# Altium project Compass.PrjPcb
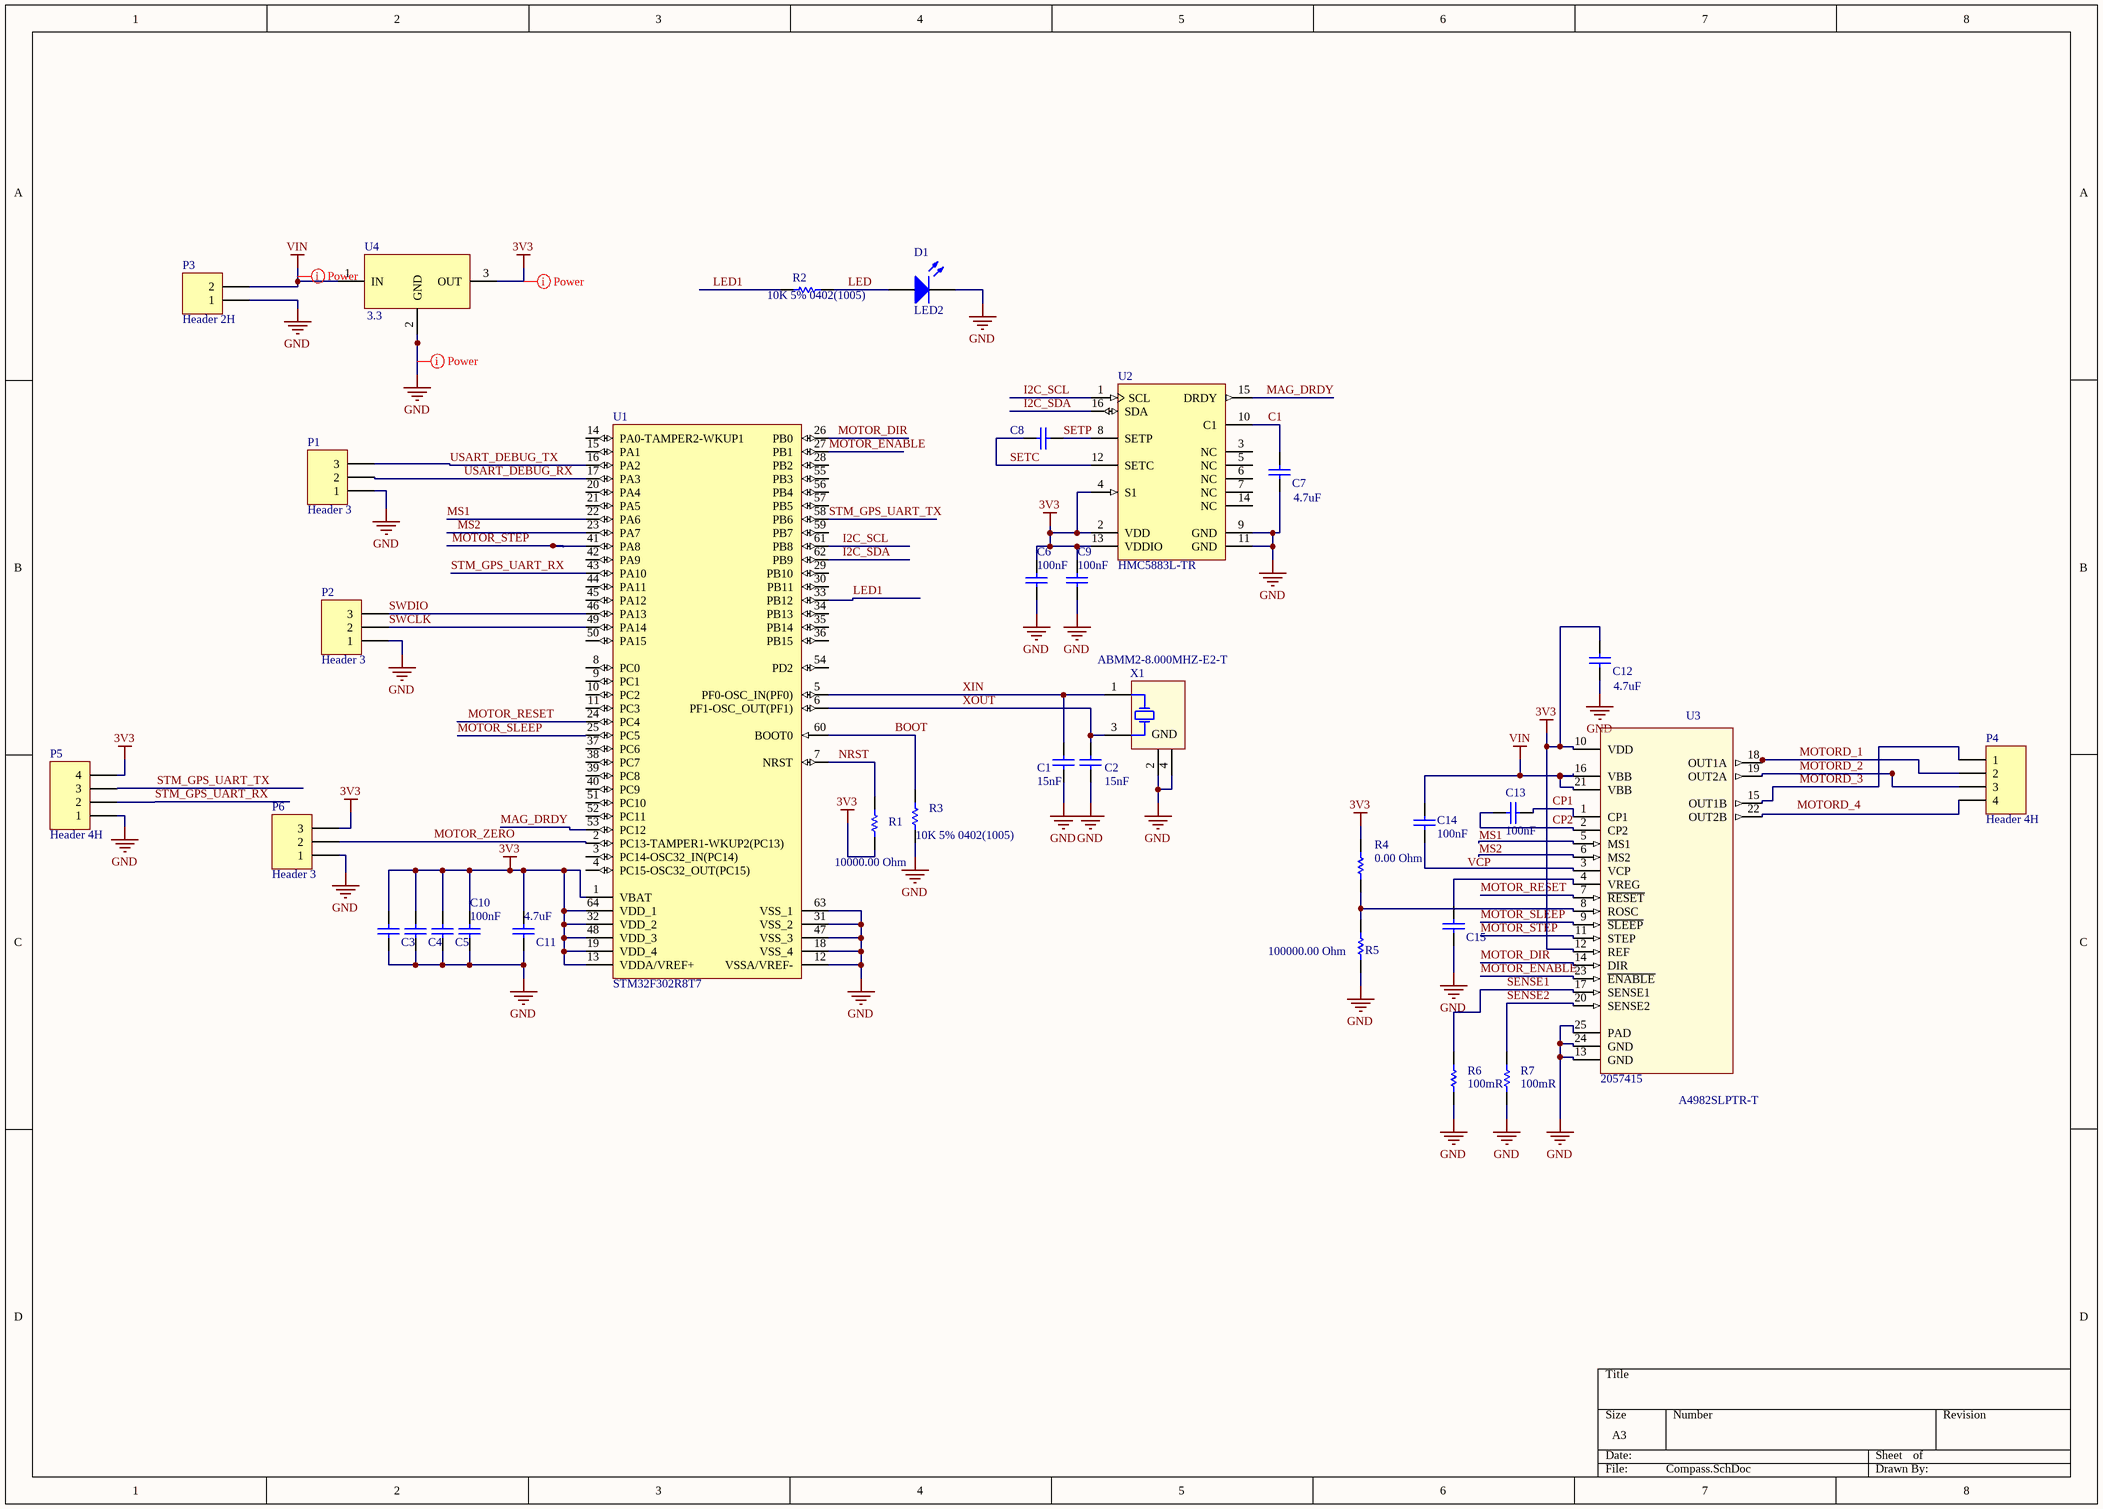
[diagram p0: Compass.SchDoc]
1 sheet, 34 parts. Net scope: global (net labels, ports and power ports of the same name join across sheets).

## Sheet Compass.SchDoc
size A3

### Parts
C1  value 15nF  [CAPC0402(1005)60_M]  (hidden comment: CAP 15nF 6.3V 0402(1005))
C2  value 15nF  [CAPC0402(1005)60_M]  (hidden comment: CAP 15nF 6.3V 0402(1005))
C3  CAP 100nF 6.3V 0603(1608)  [CAPC0603(1608)100_M]  (value not drawn)
C4  CAP 100nF 6.3V 0603(1608)  [CAPC0603(1608)100_M]  (value not drawn)
C5  CAP 100nF 6.3V 0603(1608)  [CAPC0603(1608)100_M]  (value not drawn)
C6  value 100nF  [CAPC0603(1608)100_M]  (hidden comment: CAP 100nF 6.3V 0603(1608))
C7  value 4.7uF  [CAPC0603(1608)100_M]  (hidden comment: CAP 4.7uF 6.3V 0603(1608))
C8  CAP 220nF 6.3V 0402(1005)  [CAPC0402(1005)60_L]  (value not drawn)
C9  value 100nF  [CAPC0603(1608)100_M]  (hidden comment: CAP 100nF 6.3V 0603(1608))
C10  value 100nF  [CAPC0603(1608)100_M]  (hidden comment: CAP 100nF 6.3V 0603(1608))
C11  value 4.7uF  [CAPC0603(1608)100_M]  (hidden comment: CAP 4.7uF 6.3V 0603(1608))
C12  value 4.7uF  [CAPC0603(1608)100_M]  (hidden comment: CAP 4.7uF 6.3V 0603(1608))
C13  value 100nF  [CAPC0603(1608)100_M]  (hidden comment: CAP 100nF 6.3V 0603(1608))
C14  value 100nF  [CAPC0603(1608)100_M]  (hidden comment: CAP 100nF 6.3V 0603(1608))
C15  CAP 220nF 6.3V 0402(1005)  [CAPC0402(1005)60_L]  (value not drawn)
D1  LED2  [3.2X1.6X1.1]
P1  Header 3  [HDR1X3]
P2  Header 3  [HDR1X3]
P3  Header 2H  [HDR1X2H]
P4  Header 4H  [HDR1X4H]
P5  Header 4H  [HDR1X4H]
P6  Header 3  [HDR1X3]
R1  value 10000.00 Ohm  [RESC0402(1005)_N]  (hidden comment: 10K 5% 0402(1005))
R2  10K 5% 0402(1005)  [RESC0402(1005)_N]
R3  10K 5% 0402(1005)  [RESC0402(1005)_N]
R4  value 0.00 Ohm  [RESC0402(1005)_N]  (hidden comment: Jumper 0402(1005))
R5  value 100000.00 Ohm  [RESC0402(1005)_M]  (hidden comment: 100K 1% 0402(1005))
R6  value 100mR  [RESC0603(1608)_L]  (hidden comment: RES0603)
R7  value 100mR  [RESC0603(1608)_L]  (hidden comment: RES0603)
U1  STM32F302R8T7  [STM-LQFP64_N]
U2  HMC5883L-TR  [HONEY-LPCC-16_V]
U3  A4982SLPTR-T  Supplier Part Number 1: 2057415  [*SOP65P640X120-25N]
U4  3.3  [SIP-3]
X1  ABMM2-8.000MHZ-E2-T  [ABRA-ABMM2-4_V]

### Nets
3V3: C3.2 C4.2 C5.2 C6.2 C9.2 C10.2 C11.2 C12.2 P5.4 P6.3 R1.1 R4.2 U1.1(VBAT) U1.13(VDDA/VREF+) U1.19(VDD_4) U1.32(VDD_2) U1.48(VDD_3) U1.64(VDD_1) U2.2(VDD) U2.4(S1) U2.13(VDDIO) U3.10(VDD) U3.12(REF) U4.3(OUT)
16: C14.2 P3.2 U3.16(VBB) U3.21(VBB) U4.1(IN)  [also labelled VIN]
GND: C1.1 C2.1 C3.1 C4.1 C5.1 C6.1 C7.1 C9.1 C10.1 C11.1 C12.1 C15.1 D1.2(K) P1.1 P2.1 P3.1 P5.1 P6.1 R3.1 R5.1 R6.1 R7.1 U1.12(VSSA/VREF-) U1.18(VSS_4) U1.31(VSS_2) U1.47(VSS_3) U1.63(VSS_1) U2.9(GND) U2.11(GND) U3.13(GND) U3.24(GND) U3.25(PAD) U4.2(GND) X1.2(GND) X1.4(GND)
BOOT: R3.2 U1.60(BOOT0)
C1: C7.2 U2.10(C1)
CP1: C13.1 U3.1(CP1)
CP2: C13.2 U3.2(CP2)
I2C_SCL: U1.61(PB8) U2.1(SCL)
I2C_SDA: U1.62(PB9) U2.16(SDA)
LED: D1.1(A) R2.1
LED1: R2.2 U1.33(PB12)
MAG_DRDY: U1.53(PC12) U2.15(DRDY)
MOTOR_DIR: U1.26(PB0) U3.14(DIR)
MOTOR_ENABLE: U1.27(PB1) U3.23(~{ENABLE})
MOTOR_RESET: U1.24(PC4) U3.7(~{RESET})
MOTOR_SLEEP: U1.25(PC5) U3.9(~{SLEEP})
MOTOR_STEP: U1.41(PA8) U3.11(STEP)
MOTOR_ZERO: P6.2 U1.2(PC13-TAMPER1-WKUP2(PC13))
MOTORD_1: P4.2 U3.18(OUT1A)
MOTORD_2: P4.3 U3.19(OUT2A)
MOTORD_3: P4.1 U3.15(OUT1B)
MS1: U1.22(PA6) U3.5(MS1)
MS2: U1.23(PA7) U3.6(MS2)
NRST: R1.2 U1.7(NRST)
SENSE1: R6.2 U3.17(SENSE1)
SENSE2: R7.2 U3.20(SENSE2)
SETC: C8.1 U2.12(SETC)
SETP: C8.2 U2.8(SETP)
STM_GPS_UART_RX: P5.2 U1.43(PA10)
STM_GPS_UART_TX: P5.3 U1.58(PB6)
SWCLK: P2.2 U1.49(PA14)
SWDIO: P2.3 U1.46(PA13)
USART_DEBUG_RX: P1.2 U1.17(PA3)
USART_DEBUG_TX: P1.3 U1.16(PA2)
XIN: C1.2 U1.5(PF0-OSC_IN(PF0)) X1.1(X1)
XOUT: C2.2 U1.6(PF1-OSC_OUT(PF1)) X1.3(X2)
NetC14_1: C14.1 U3.3(VCP)
NetC15_2: C15.2 U3.4(VREG)
NetP4_4: P4.4 U3.22(OUT2B)
NetR4_1: R4.1 R5.2 U3.8(ROSC)

Not connected (* = marked no-connect by the designer): U1 3(PC14-OSC32_IN(PC14)) 4(PC15-OSC32_OUT(PC15)) 8(PC0) 9(PC1) 10(PC2) 11(PC3) 14(PA0-TAMPER2-WKUP1) 15(PA1) 20(PA4) 21(PA5) 28(PB2) 29(PB10) 30(PB11) 34(PB13) 35(PB14) 36(PB15) 37(PC6) 38(PC7) 39(PC8) 40(PC9) 42(PA9) 44(PA11) 45(PA12) 50(PA15) 51(PC10) 52(PC11) 54(PD2) 55(PB3) 56(PB4) 57(PB5) 59(PB7); U2 3(NC) 5(NC) 6(NC) 7(NC) 14(NC)

### Layout directives
net class Undefined: 3V3, 16
Power: Power: GND

### Notes on the sheet
- Labels drawn without touching a wire or pin: MOTORD_4, VCP

### Library data of the parts
C1 C2 = CMP-1034-01907-1: CAP 15nF 6.3V ±20% 0402 (1005 Metric) Thickness 0.6mm SMD; Case-EIA: 0402; Tolerance: Â±20%; Case-Metric: 1005; Technology: SMT; Rated Voltage: 6.3 V; Max Thickness: 0.6 mm
C3-C6 C9 C10 C13 C14 = CMP-1035-02576-1: CAP 100nF 6.3V ±10% 0603 (1608 Metric) Thickness 1mm SMD; Tolerance: Â±10%; Case-Metric: 1608; Case-EIA: 0603; Max Thickness: 1 mm; Rated Voltage: 6.3 V; Technology: SMT
  C3-C5: Value: 100nF
C7 C11 C12 = CMP-1035-02782-1: CAP 4.7uF 6.3V ±20% 0603 (1608 Metric) Thickness 1mm SMD; Case-EIA: 0603; Tolerance: Â±20%; Case-Metric: 1608; Technology: SMT; Rated Voltage: 6.3 V; Max Thickness: 1 mm
C8 C15 = CMP-1034-02083-1: CAP 220nF 6.3V ±10% 0402 (1005 Metric) Thickness 0.6mm SMD; Case-EIA: 0402; Tolerance: Â±10%; Case-Metric: 1005; Value: 220nF; Rated Voltage: 6.3 V; Technology: SMT; Max Thickness: 0.6 mm
D1 = LED2: Typical RED, GREEN, YELLOW, AMBER GaAs LED; Published: 8-Jun-2000; LatestRevisionDate: 17-Jul-2002; LatestRevisionNote: Re-released for DXP Platform.; PackageVersion: Feb-2002; PackageReference: 3.2X1.6X1.1; Publisher: Altium Limited; PackageDescription: SM LED; 2 Flat Leads
P1 P2 P6 = Header 3: Header, 3-Pin; LatestRevisionDate: 17-Jul-2002; LatestRevisionNote: Re-released for DXP Platform.; Publisher: Altium Limited
P3 = Header 2H: Header, 2-Pin, Right Angle; LatestRevisionDate: 17-Jul-2002; LatestRevisionNote: Re-released for DXP Platform.; Publisher: Altium Limited
P4 P5 = Header 4H: Header, 4-Pin, Right Angle; LatestRevisionDate: 17-Jul-2002; LatestRevisionNote: Re-released for DXP Platform.; Publisher: Altium Limited
R1 = CMP-1011-00098-1: 10K 0.063W 5% 0402 (1005 Metric)  SMD; Case-Metric: 1005; Case-EIA: 0402; Technology: SMT; Tolerance: 5 %; Power: 0.063 W
R2 R3 = CMP-1011-00098-1: 10K 0.063W 5% 0402 (1005 Metric)  SMD; Case-Metric: 1005; Value: 10000.00 Ohm; Case-EIA: 0402; Technology: SMT; Tolerance: 5 %; Power: 0.063 W
R4 = CMP-1011-00001-1: Jumper 0402 (1005 Metric); Tolerance: None; Case-Metric: 1005; Case-EIA: 0402; Power: None; Technology: SMT
R5 = CMP-1011-00736-1: 100K 0.063W 1% 0402 (1005 Metric)  SMD; Case-EIA: 0402; Case-Metric: 1005; Power: 0.063 W; Tolerance: 1 %; Technology: SMT
R6 R7 = CMP-1591-00001-1: 0603 (1608 Metric) Chip Resistor; Case-Metric: 1608; Case-EIA: 0603; PackageReference: RESC0603(1608)
U1 = CMP-0537-00020-1: ARM Cortex-M4 32-bit MCU, 64 KB Flash, 16 KB Internal RAM, 51 I/Os, 64-Pin LQFP, -40 to 105 degC, Tray; D/A Converter: 1; FLASH Size (Prog) (kB): 64; I/Os (High Current): 51; Supply Voltage(Vcc) min (V): 2; Operating Frequency(F) (Processor speed) (MHz): 72; Internal RAM Size (kB): 16; Packing: Tray; ComponentLink1Description: Manufacturer URL; Package Reference: LQFP64; Core: ARM Cortex-M4; ComponentLink2URL: http://www.st.com/st-web-ui/static/active/en/resource/technical/document/datasheet/DM00093333.pdf; ComponentLink1URL: http://www.st.com/; ComponentLink2Description: Datasheet; Package Description: 64-Pin Low-profile Quad Flat Package, Body 10 x 10 mm, Pitch 0.5 mm; DatasheetVersion: Rev. 5; Mounting Technology: Surface Mount
U2 = CMP-2000-05148-1: Three-Axis Digital Compass IC, 2.16 to 3.6 V, -30 to 85 degC, 16-Pin PLCC, RoHS, Tape and Reel; Manufacturer: Honeywell; Dynamic Catalog: HMCSeries; Other Names: 342-1082-6; Sensing Range: ±8G; Current - Supply: 100µA; Output Type: DifferentialVoltage; Product Training Modules: HMC5883LThreeAxisCompassIC; Voltage - Supply: 2.16V~3.6V; Product Change Notification: HMC5883L-TRIdleCurrentChange13/Apr/2012; Supplier Device Package: 16-LCC; Features: Compass-ThreeAxis; Package / Case: 16-LCC; Datasheet Version: Rev. C, 04/2012; Category: Sensors,Transducers; Packaging: Digi-Reel; Series: HMC; Type: Compass-ThreeAxis; Family: MagneticSensors-HallEffect,DigitalSwitch,Linear,Compass(ICs); Operating Temperature: -30degC~85degC; Standard Package: 1; Manufacturer URL: http://honeywell.com/Pages/Home.aspx; Datasheet URL: https://datasheet.ciiva.com/1314/1683374-1314148.pdf
U3 = A4982SLPTR-T: DMOS Microstepping Driver with Translator and Overcurrent Protection; MF: Allegro; Availability: Unavailable; Price: None; MP: A4982SLPTR-T; Package: TSSOP-24 Allegro MicroSystems LLC; SnapEDA_Link: https://www.snapeda.com/parts/A4982SLPTR-T/Allegro%20Industries/view-part/?ref=snap; Value: *; Supplier 1: Farnell
U4 = PSU: 3V3 SMPS; VOUT: 3.3; Supplier 1: Farnell; Supplier Part Number 1: 2319829
X1 = CMP-0277-00003-1: Ceramic Surface Mount Low Profile Quartz Crystal, 8 MHz, -20 to 70 degC, 4-Pin 6 x 3.6 x 1.2 mm SMD, RoHS, 1000pcs / Reel; Manufacturer: Abracon; ESR: 72 Ohm Max.; Frequency: 8 MHz; Shunt Capacitance C0: 7 pF Max.; Load Capacitance CL: 18 pF Typ.; ComponentLink3Description: Package Specification; PackageDescription: 4-Pin SMD, Body 6 x 3.6 mm, Pitch 4.4 mm; DatasheetVersion: Jan-13; ComponentLink1URL: http://www.abracon.com/; ComponentLink2URL: http://www.abracon.com/Resonators/ABMM2.pdf; Temperature Range: -20 to 70 degC; Mounting Technology: Surface Mount; RoHS: TRUE; PartNumber: ABMM2-8.000MHZ-E2-T; ComponentLink2Description: Datasheet; ComponentLink3URL: http://www.abracon.com/Resonators/ABMM2.pdf; ComponentLink1Description: Manufacturer URL; Packing: 1000pcs / Reel